# Altium project radxa_cm3_io_board_v1360_schematic.PrjPcb (part 4 of 5)

## Sheet 15.Power-DC IN.SchDoc: CM3 IO
size 420 x 297 mm; Page Create Date: March  8, 1995; Page Number: 15; Page Size: A3; Comment: radxa_1010; Page Count: 20; RevCode: 1.36; Doc: Power-DC IN; DsnPath: D:\WMS\黄工\[RC119]CM3_IO_V1.36\对外资料\radxa_cm3_io_board_v1360.DSN; SchematicName: CM3_IO V1.36; PageName: 15.Power-DC IN; PageSize: A3; TopSchematic: True
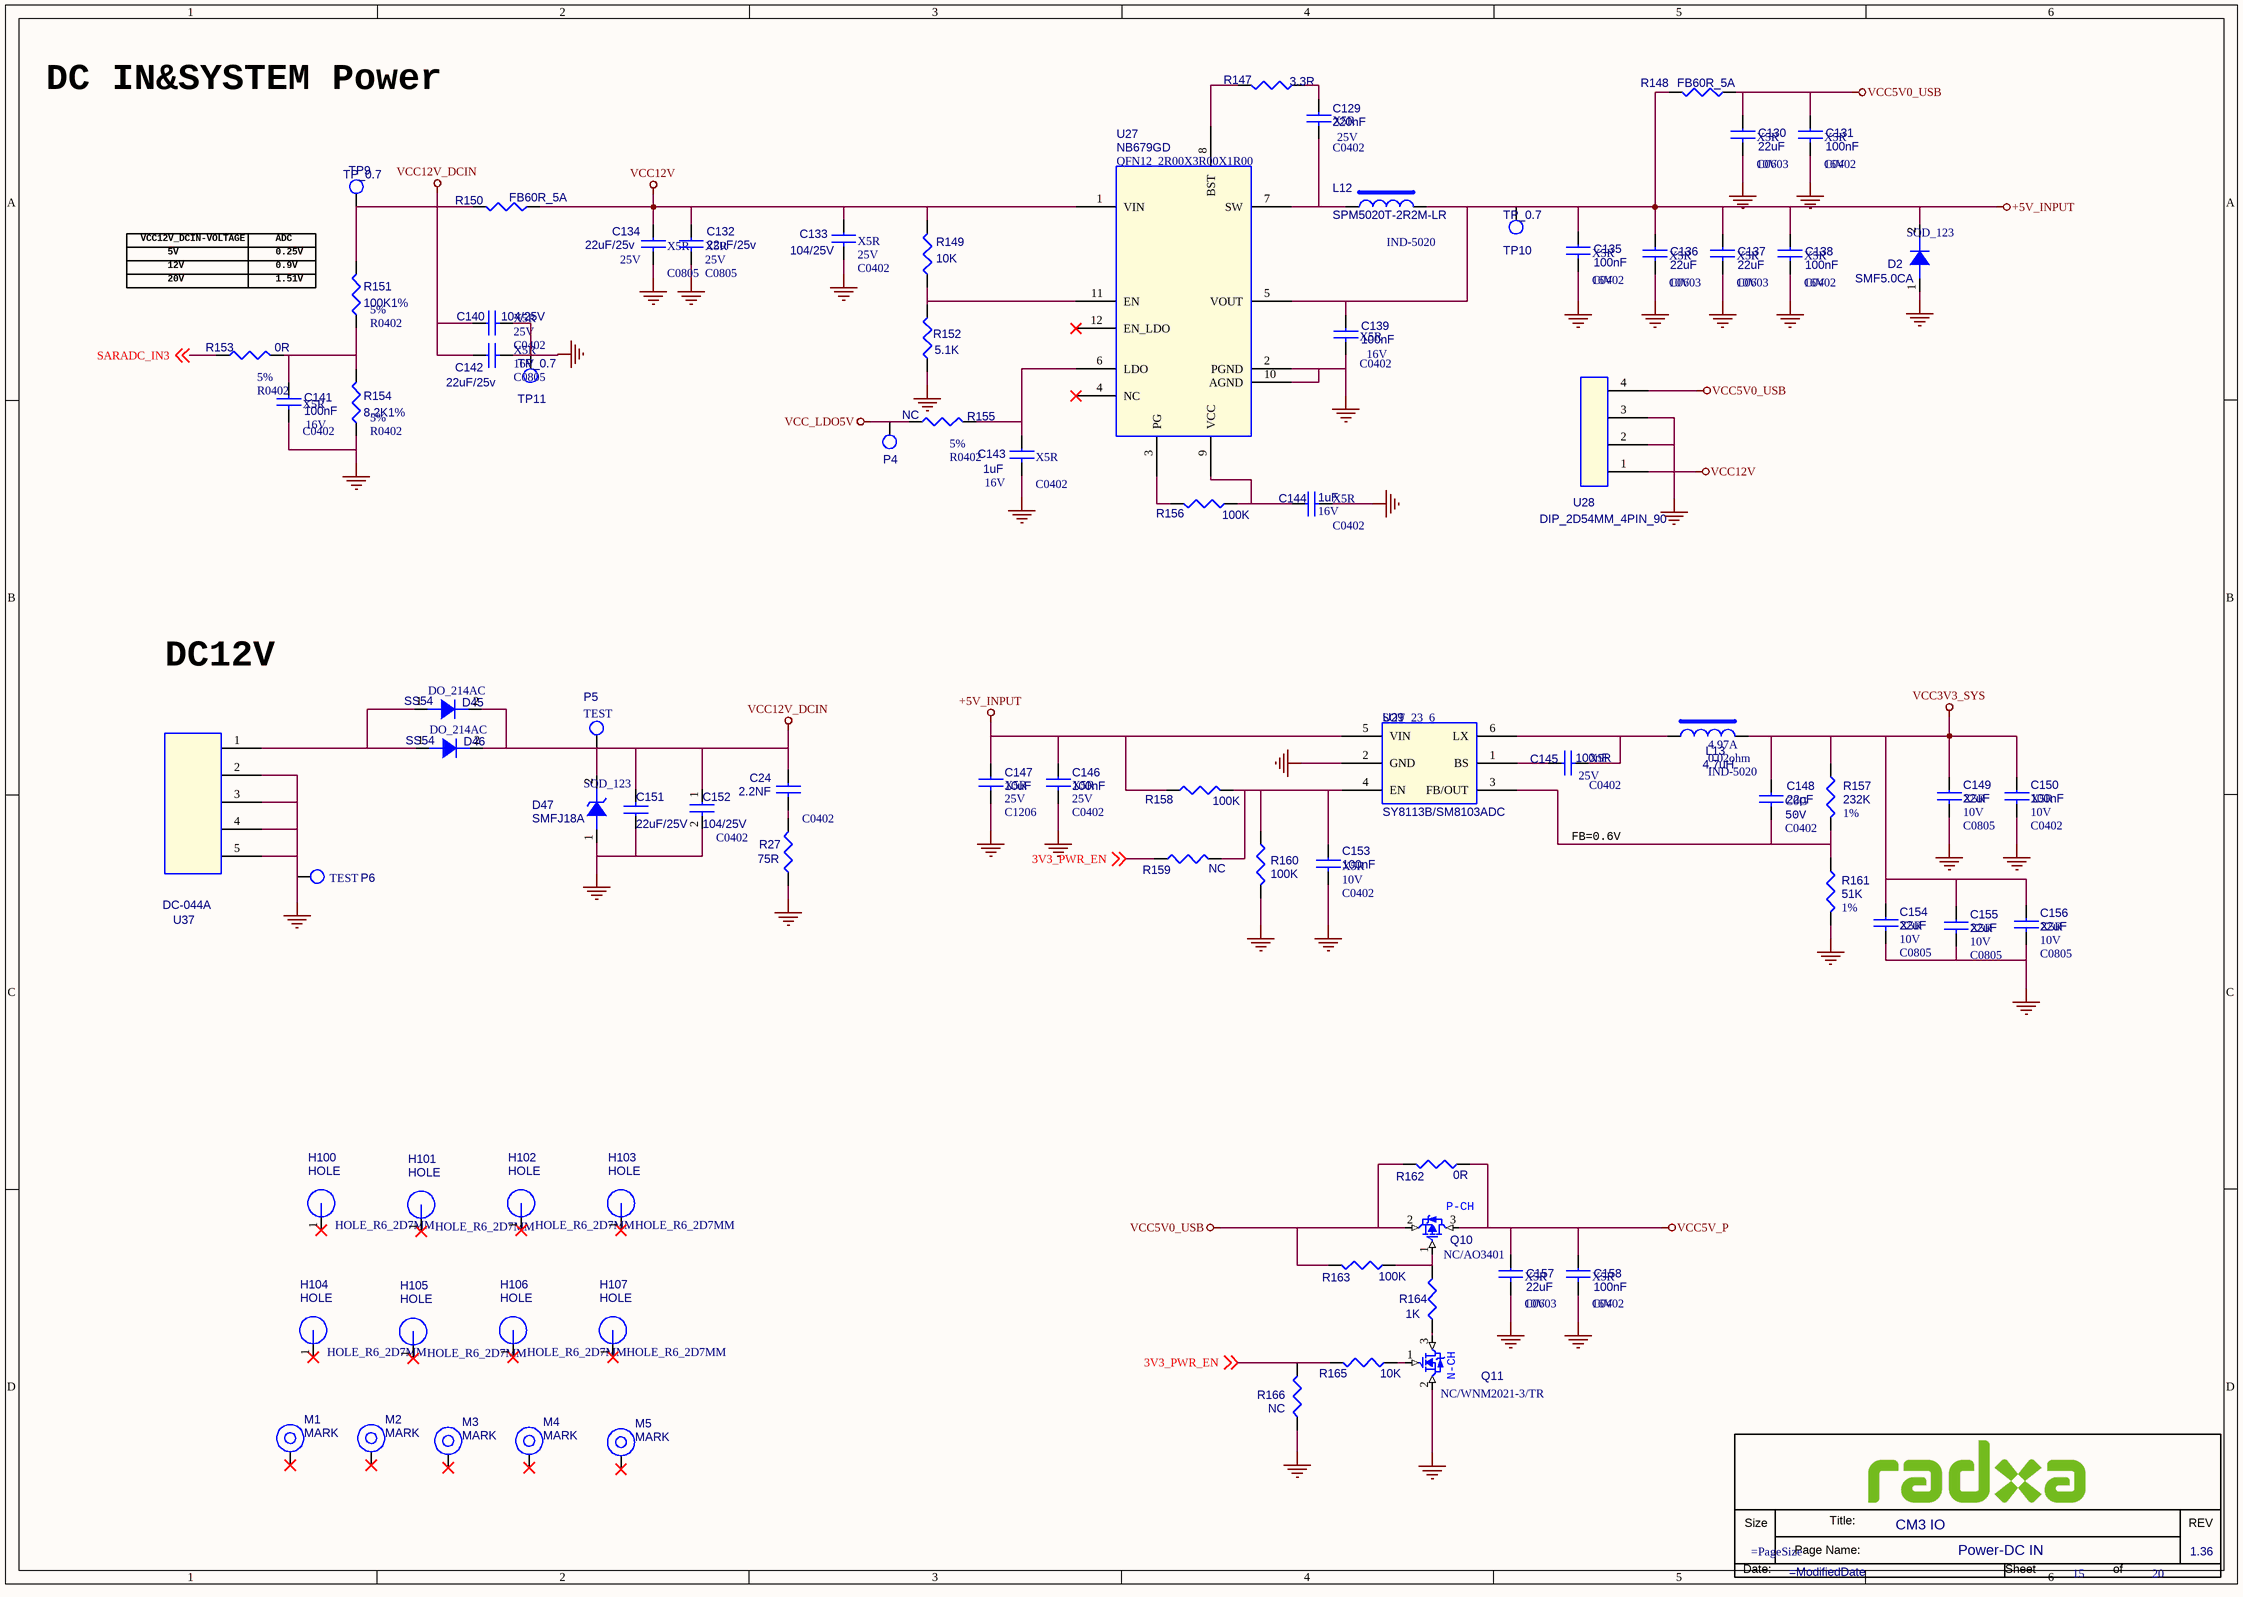
[diagram p13: 15.Power-DC IN.SchDoc]

### Parts
(Parts that share a designator on the sheet are numbered #1, #2 ... from top to bottom, then left to right.)
*#14  Doc: Power-DC IN  RevCode: 1.36  Title: CM3 IO  Page Number: 15  Page Count: 20  (hidden comment: radxa_1010)  (graphical)
C24  2.2NF  [C0402]
C129  220nF  Voltage: 25V  Dielectric: X5R  [C0402]
C130  22uF  Voltage: 10V  Dielectric: X5R  [C0603]
C131  100nF  Voltage: 16V  Dielectric: X5R  [C0402]
C132  22uF/25v  Voltage: 25V  Dielectric: X5R  [C0805]
C133  104/25V  Voltage: 25V  Dielectric: X5R  [C0402]
C134  22uF/25v  Voltage: 25V  Dielectric: X5R  [C0805]
C135  100nF  Voltage: 16V  Dielectric: X5R  [C0402]
C136  22uF  Voltage: 10V  Dielectric: X5R  [C0603]
C137  22uF  Voltage: 10V  Dielectric: X5R  [C0603]
C138  100nF  Voltage: 16V  Dielectric: X5R  [C0402]
C139  100nF  Voltage: 16V  Dielectric: X5R  [C0402]
C140  104/25V  Voltage: 25V  Dielectric: X5R  [C0402]
C141  100nF  Voltage: 16V  Dielectric: X5R  [C0402]
C142  22uF/25v  Voltage: 16V  Dielectric: X5R  [C0805]
C143  1uF  Voltage: 16V  Dielectric: X5R  [C0402]
C144  1uF  Voltage: 16V  Dielectric: X5R  [C0402]
C145  100nF  Voltage: 25V  Dielectric: X5R  [C0402]
C146  100nF  Voltage: 25V  Dielectric: X5R  [C0402]
C147  10uF  Voltage: 25V  Dielectric: X5R  [C1206]
C148  22pF  Voltage: 50V  Dielectric: C0G  [C0402]
C149  22uF  Voltage: 10V  Dielectric: X5R  [C0805]
C150  100nF  Voltage: 10V  Dielectric: X5R  [C0402]
C151  22uF/25V  [C0805]
C152  104/25V  [C0402]
C153  100nF  Voltage: 10V  Dielectric: X5R  [C0402]
C154  22uF  Voltage: 10V  Dielectric: X5R  [C0805]
C155  22uF  Voltage: 10V  Dielectric: X5R  [C0805]
C156  22uF  Voltage: 10V  Dielectric: X5R  [C0805]
C157  22uF  Voltage: 10V  Dielectric: X5R  [C0603]
C158  100nF  Voltage: 16V  Dielectric: X5R  [C0402]
D2  SMF5.0CA  [SOD_123]
D45  SS54  [DO_214AC]
D46  SS54  [DO_214AC]
D47  SMFJ18A  [SOD_123]
H100  HOLE  PCB Footprint: HOLE_R6_2D7MM  [H3.8MM]
H101  HOLE  PCB Footprint: HOLE_R6_2D7MM  [H3.8MM]
H102  HOLE  PCB Footprint: HOLE_R6_2D7MM  [H3.8MM]
H103  HOLE  PCB Footprint: HOLE_R6_2D7MM  [H3.8MM]
H104  HOLE  PCB Footprint: HOLE_R6_2D7MM  [H3.8MM]
H105  HOLE  PCB Footprint: HOLE_R6_2D7MM  [H3.8MM]
H106  HOLE  PCB Footprint: HOLE_R6_2D7MM  [H3.8MM]
H107  HOLE  PCB Footprint: HOLE_R6_2D7MM  [H3.8MM]
L12  SPM5020T-2R2M-LR  [IND-5020]
L13  4.7uH  DC Resistor: 0.02ohm  Isat: 4.97A  [IND-5020]
M1  MARK  [MARK]
M2  MARK  [MARK]
M3  MARK  [MARK]
M4  MARK  [MARK]
M5  MARK  [MARK]
P4  TEST  [TEST]  (value not drawn)
P5  TEST  [TEST]
P6  TEST  [TEST]
Q10  NC/AO3401  [S0T-23]
Q11  NC/WNM2021-3/TR  [S0T-23]
R27  75R  [R0402]
R147  3.3R  [R0402]
R148  FB60R_5A  [R1206]
R149  10K  [R0402]
R150  FB60R_5A  [R1206]
R151  100K1%  Tolerance: 5%  [R0402]
R152  5.1K  [R0402]
R153  0R  Tolerance: 5%  [R0402]
R154  8.2K1%  Tolerance: 5%  [R0402]
R155  NC  Tolerance: 5%  [R0402]
R156  100K  [R0402]
R157  232K  Tolerance: 1%  [R0402]
R158  100K  [R0402]
R159  NC  [R0402]
R160  100K  [R0402]
R161  51K  Tolerance: 1%  [R0402]
R162  0R  [R0603]
R163  100K  [R0402]
R164  1K  [R0402]
R165  10K  [R0402]
R166  NC  [R0402]
TP9  TP_0.7  [TEST]
TP10  TP_0.7  [TEST]
TP11  TP_0.7  [TEST]
U27  NB679GD  PCB Footprint: QFN12_2R00X3R00X1R00  [QFN12_3R00X2R00X0R90]
U28  DIP_2D54MM_4PIN_90  [XIAO_4PIN_2D54]
U29  SY8113B/SM8103ADC  [SOT_23_6]
U37  DC-044A  [DC-044A]

### Nets
+5V_INPUT: C135.1 C136.1 C137.1 C138.1 C139.1 C146.1 C147.1 D2.2(K) L12.2 R148.2 R158.1 TP10.1 U27.5(VOUT) U29.5(VIN)
GND: C130.2 C131.2 C132.2 C133.2 C134.2 C135.2 C136.2 C137.2 C138.2 C139.2 C140.2 C141.2 C142.2 C143.2 C144.2 C146.2 C147.2 C149.2 C150.2 C151.1 C152.2 C153.2 C154.2 C155.2 C156.2 C157.2 C158.2 D2.1(A) D47.1(ANODE) P6.1 Q11.2(S) R27.1 R152.1 R154.1 R160.2 R161.2 R166.2 TP11.1 U27.2(PGND) U27.10(AGND) U28.2 U28.3 U29.2(GND) U37.2 U37.3 U37.4 U37.5
VCC3V3_SYS: C148.1 C149.1 C150.1 C154.1 C155.1 C156.1 L13.2 R157.1
VCC5V0_USB: C130.1 C131.1 Q10.2(S) R148.1 R162.2 R163.2 U28.4
VCC5V_P: C157.1 C158.1 Q10.3(D) R162.1
VCC12V: C132.1 C133.1 C134.1 R149.2 R150.1 U27.1(VIN) U28.1
VCC12V_DCIN: C24.1 C140.1 C142.1 C151.2 C152.1 D45.2(K) D46.2(K) D47.2(CATHODE) P5.1
VCC_LDO5V: P4.1 R155.1
3V3_PWR_EN: R159.1 R165.2 R166.1 ; off-sheet 3V3_PWR_EN
SARADC_IN3: R153.1 ; off-sheet SARADC_IN3
NetC24_2: C24.2 R27.2
NetC129_1: C129.1 R147.2
NetC129_2: C129.2 L12.1 U27.7(SW)
NetC141_1: C141.1 R151.1 R153.2 R154.2
NetC143_1: C143.1 R155.2 U27.6(LDO)
NetC144_1: C144.1 R156.2 U27.9(VCC)
NetC145_1: C145.1 U29.1(BS)
NetC145_2: C145.2 L13.1 U29.6(LX)
NetC148_2: C148.2 R157.2 R161.1 U29.3(FB/OUT)
NetC153_1: C153.1 R158.2 R159.2 R160.1 U29.4(EN)
NetD45_1: D45.1(A) D46.1(A) U37.1
NetQ10_1: Q10.1(G) R163.1 R164.1
NetQ11_1: Q11.1(G) R165.1
NetQ11_3: Q11.3(D) R164.2
NetR147_1: R147.1 U27.8(BST)
NetR149_1: R149.1 R152.2 U27.11(EN)
NetR150_2: R150.2 R151.2 TP9.1
NetR156_1: R156.1 U27.3(PG)

Not connected (* = marked no-connect by the designer): H100 1*; H101 1*; H102 1*; H103 1*; H104 1*; H105 1*; H106 1*; H107 1*; M1 1*; M2 1*; M3 1*; M4 1*; M5 1*; U27 4(NC)* 12(EN_LDO)*

### Notes on the sheet
- DC IN&SYSTEM Power
- VCC12V_DCIN-VOLTAGE
- 5V
- ADC
- 0.25V
- 12V
- 20V
- 1.51V
- 0.9V
- DC12V
- FB=0.6V
- (in symbol N-MOSFET) N-CH
- (in symbol P-MOSFET) P-CH
- (in symbol radxa_1010) Size; Title:; REV; Page Name:; Date:; Sheet; of

### Library data of the parts
C24 = CAP NP_0: Part Reference: C24; Priority: A; PCB Footprint: C0402; Value: 2.2NF
C129 = CAP NP_0: cap,220.00nF,+/-10%,25V,X5R,C0402; Part Reference: C129; Manufacturer PN: C1005X5R1E224K050BC; Manufacturer: TDK; Tolerance: 10%; Priority: A; PCB Footprint: C0402; Value: 220nF; Created by: JJJ; Part Type: C0402; RK PN: C1005X5R1E224K050BC
C130 = CAP NP_0: cap,22.00uF,+/-10%,10V,X5R,C0805; Part Reference: C130; Manufacturer PN: C2012X5R1A226K125AB; Manufacturer: TDK; Tolerance: 10%; Priority: A; PCB Footprint: C0603; Value: 22uF; Created by: JJJ; Part Type: C0805; RK PN: C2012X5R1A226K125AB
C131 = CAP NP_0: cap,100.00nF,+/-10%,16V,X5R,C0402; Part Reference: C131; Manufacturer: TDK; RK PN: C1005X5R1C104K050BA; Priority: A; Tolerance: 10%; PCB Footprint: C0402; Value: 100nF; Part Type: C0402; Manufacturer PN: C1005X5R1C104K050BA; Created by: JJJ
C132 = CAP NP_0: cap,10.00uF,+/-10%,16V,X5R,C0805; Part Reference: C132; Manufacturer PN: C2012X5R1C106K125AC; Manufacturer: TDK; Tolerance: 10%; Priority: A; PCB Footprint: C0805; Value: 22uF/25v; Created by: JJJ; Part Type: C0805; RK PN: C2012X5R1C106K125AC
C133 = CAP NP_0: cap,1.00uF,+/-10%,16V,X5R,C0402; Part Reference: C133; Manufacturer: TDK; RK PN: C1005X5R1C105K050BC; Priority: A; Tolerance: 10%; PCB Footprint: C0402; Value: 104/25V; Part Type: C0402; Manufacturer PN: C1005X5R1C105K050BC; Created by: JJJ
C134 = CAP NP_0: cap,10.00uF,+/-10%,16V,X5R,C0805; Part Reference: C134; Manufacturer: TDK; RK PN: C2012X5R1C106K125AC; Priority: A; Tolerance: 10%; PCB Footprint: C0805; Value: 22uF/25v; Part Type: C0805; Manufacturer PN: C2012X5R1C106K125AC; Created by: JJJ
C135 = CAP NP_0: cap,100.00nF,+/-10%,16V,X5R,C0402; Part Reference: C135; Manufacturer: TDK; RK PN: C1005X5R1C104K050BA; Priority: A; Tolerance: 10%; PCB Footprint: C0402; Value: 100nF; Part Type: C0402; Manufacturer PN: C1005X5R1C104K050BA; Created by: JJJ
C136 = CAP NP_0: cap,22.00uF,+/-10%,10V,X5R,C0805; Part Reference: C136; Manufacturer PN: C2012X5R1A226K125AB; Manufacturer: TDK; Tolerance: 10%; Priority: A; PCB Footprint: C0603; Value: 22uF; Created by: JJJ; Part Type: C0805; RK PN: C2012X5R1A226K125AB
C137 = CAP NP_0: cap,22.00uF,+/-10%,10V,X5R,C0805; Part Reference: C137; Manufacturer PN: C2012X5R1A226K125AB; Manufacturer: TDK; Tolerance: 10%; Priority: A; PCB Footprint: C0603; Value: 22uF; Created by: JJJ; Part Type: C0805; RK PN: C2012X5R1A226K125AB
C138 = CAP NP_0: cap,100.00nF,+/-10%,16V,X5R,C0402; Part Reference: C138; Manufacturer: TDK; RK PN: C1005X5R1C104K050BA; Priority: A; Tolerance: 10%; PCB Footprint: C0402; Value: 100nF; Part Type: C0402; Manufacturer PN: C1005X5R1C104K050BA; Created by: JJJ
C139 = CAP NP_0: cap,100.00nF,+/-10%,16V,X5R,C0402; Part Reference: C139; Manufacturer PN: C1005X5R1C104K050BA; Manufacturer: TDK; Tolerance: 10%; Priority: A; PCB Footprint: C0402; Value: 100nF; Created by: JJJ; Part Type: C0402; RK PN: C1005X5R1C104K050BA
C140 = CAP NP_0: cap,1.00uF,+/-10%,16V,X5R,C0402; Part Reference: C140; Manufacturer PN: C1005X5R1C105K050BC; Manufacturer: TDK; Tolerance: 10%; Priority: A; PCB Footprint: C0402; Value: 104/25V; Created by: JJJ; Part Type: C0402; RK PN: C1005X5R1C105K050BC
C141 = CAP NP_0: cap,100.00nF,+/-10%,16V,X5R,C0402; Part Reference: C141; Manufacturer: TDK; RK PN: C1005X5R1C104K050BA; Priority: A; Tolerance: 10%; PCB Footprint: C0402; Value: 100nF; Part Type: C0402; Manufacturer PN: C1005X5R1C104K050BA; Created by: JJJ
C142 = CAP NP_0: cap,10.00uF,+/-10%,16V,X5R,C0805; Part Reference: C142; Manufacturer PN: C2012X5R1C106K125AC; Manufacturer: TDK; Tolerance: 10%; Priority: A; PCB Footprint: C0805; Value: 22uF/25v; Created by: JJJ; Part Type: C0805; RK PN: C2012X5R1C106K125AC
C143 = CAP NP_0: cap,1.00uF,+/-10%,16V,X5R,C0402; Part Reference: C143; Manufacturer PN: C1005X5R1C105K050BC; Manufacturer: TDK; Tolerance: 10%; Priority: A; PCB Footprint: C0402; Value: 1uF; Created by: JJJ; Part Type: C0402; RK PN: C1005X5R1C105K050BC
C144 = CAP NP_0: cap,1.00uF,+/-10%,16V,X5R,C0402; Part Reference: C144; Manufacturer PN: C1005X5R1C105K050BC; Manufacturer: TDK; Tolerance: 10%; Priority: A; PCB Footprint: C0402; Value: 1uF; Created by: JJJ; Part Type: C0402; RK PN: C1005X5R1C105K050BC
C145 = CAP NP_0: cap,100.00nF,+/-10%,25V,X5R,C0402; Part Reference: C145; Manufacturer: TDK; Number: 37; RK PN: C1005X5R1E104K050BC; Priority: A; Tolerance: 10%; C_Voltage: 6.3V; PCB Footprint: C0402; Value: 100nF; Part Type: C0402; Manufacturer PN: C1005X5R1E104K050BC; Created by: JJJ
C146 = CAP NP_0: cap,100.00nF,+/-10%,25V,X5R,C0402; Part Reference: C146; Manufacturer PN: C1005X5R1E104K050BC; Manufacturer: TDK; Tolerance: 10%; Priority: A; PCB Footprint: C0402; Value: 100nF; Created by: JJJ; Part Type: C0402; RK PN: C1005X5R1E104K050BC
C147 = CAP NP_0: cap,10.00uF,+/-10%,25V,X5R,C1206; Part Reference: C147; Manufacturer: TDK; RK PN: C3216X5R1E106K085AC; Priority: A; C_Voltage: 6.3V; Tolerance: 10%; PCB Footprint: C1206; Value: 10uF; Part Type: C1206; Manufacturer PN: C3216X5R1E106K085AC; Created by: JJJ
C148 = CAP NP_0: cap,22.00pF,+/-5%,50V,C0G,C0402; Part Reference: C148; Manufacturer: TDK; RK PN: C1005C0G1H220J050BA; Priority: A; Tolerance: 5%; PCB Footprint: C0402; Value: 22pF; Part Type: C0402; Manufacturer PN: C1005C0G1H220J050BA; Created by: JJJ
C149 = CAP NP_0: cap,22.00uF,+/-10%,10V,X5R,C0805; Part Reference: C149; Manufacturer: TDK; RK PN: C2012X5R1A226K125AB; Priority: A; C_Voltage: 6.3V; Tolerance: 10%; PCB Footprint: C0805; Value: 22uF; Part Type: C0805; Manufacturer PN: C2012X5R1A226K125AB; Created by: JJJ
C150 = CAP NP_0: cap,100.00nF,+/-10%,10V,X5R,C0402; Part Reference: C150; Manufacturer: TDK; Number: 37; RK PN: C1005X5R1A104K050BA; Priority: A; Tolerance: 10%; C_Voltage: 6.3V; PCB Footprint: C0402; Value: 100nF; Part Type: C0402; Manufacturer PN: C1005X5R1A104K050BA; Created by: JJJ
C151 = CAP NP_4: Part Reference: C151; Value: 22uF/25V; PCB Footprint: C0805
C152 = CAP NP: CAP,MLCC,1nF,+/-10%,X5R,6.3V,SMD0402; Part Reference: C152; MARK: 22P; ROOM: USB+5V; PCB Footprint: C0402; Value: 104/25V
C153 = CAP NP_0: cap,100.00nF,+/-10%,10V,X5R,C0402; Part Reference: C153; Manufacturer PN: C1005X5R1A104K050BA; Manufacturer: TDK; C_Voltage: 6.3V; Tolerance: 10%; Priority: A; Number: 37; PCB Footprint: C0402; Value: 100nF; Created by: JJJ; Part Type: C0402; RK PN: C1005X5R1A104K050BA
C154 = CAP NP_0: cap,22.00uF,+/-10%,10V,X5R,C0805; Part Reference: C154; Manufacturer PN: C2012X5R1A226K125AB; Manufacturer: TDK; Tolerance: 10%; C_Voltage: 6.3V; Priority: A; PCB Footprint: C0805; Value: 22uF; Created by: JJJ; Part Type: C0805; RK PN: C2012X5R1A226K125AB
C155 = CAP NP_0: cap,22.00uF,+/-10%,10V,X5R,C0805; Part Reference: C155; Manufacturer: TDK; RK PN: C2012X5R1A226K125AB; Priority: A; C_Voltage: 6.3V; Tolerance: 10%; PCB Footprint: C0805; Value: 22uF; Part Type: C0805; Manufacturer PN: C2012X5R1A226K125AB; Created by: JJJ
C156 = CAP NP_0: cap,22.00uF,+/-10%,10V,X5R,C0805; Part Reference: C156; Manufacturer PN: C2012X5R1A226K125AB; Manufacturer: TDK; Tolerance: 10%; C_Voltage: 6.3V; Priority: A; PCB Footprint: C0805; Value: 22uF; Created by: JJJ; Part Type: C0805; RK PN: C2012X5R1A226K125AB
C157 = CAP NP_0: cap,22.00uF,+/-10%,10V,X5R,C0805; Part Reference: C157; Manufacturer: TDK; RK PN: C2012X5R1A226K125AB; Priority: A; Tolerance: 10%; PCB Footprint: C0603; Value: 22uF; Part Type: C0805; Manufacturer PN: C2012X5R1A226K125AB; Created by: JJJ
C158 = CAP NP_0: cap,100.00nF,+/-10%,16V,X5R,C0402; Part Reference: C158; Manufacturer: TDK; RK PN: C1005X5R1C104K050BA; Priority: A; Tolerance: 10%; PCB Footprint: C0402; Value: 100nF; Part Type: C0402; Manufacturer PN: C1005X5R1C104K050BA; Created by: JJJ
D2 = DIODE: Schottky Barrier，B5819WS SOD-323; Part Reference: D2; Manufacturer: 长电; Priority: A; PCB Footprint: SOD_123; Value: SMF5.0CA; Created by: JJJ; Manufacturer PN: B5819WS; Part Type: Schottky rectifier; RK PN: B5819WS
D45 = DIODE: Schottky Barrier，SS32 DO214AC; Part Reference: D45; Manufacturer PN: SS32; Manufacturer: 星海; Priority: A; ROOM: CHG; PCB Footprint: DO_214AC; Value: SS54; Created by: JJJ; Part Type: Schottky rectifier; RK PN: SS32
D46 = DIODE: Schottky Barrier，SS32 DO214AC; Part Reference: D46; Manufacturer: 星海; ROOM: CHG; RK PN: SS32; Priority: A; PCB Footprint: DO_214AC; Value: SS54; Part Type: Schottky rectifier; Manufacturer PN: SS32; Created by: JJJ
D47 = DIODE ZENER1: 1-Line, Uni-directional, Transient Voltage Suppressor; Part Reference: D47; Manufacturer PN: ESD5621W-2/TR; Manufacturer: WillSemi(韦尔半导体); Priority: A; PCB Footprint: SOD_123; Value: SMFJ18A; Created by: JJJ; Part Type: ESD_TVS; RK PN: ESD5621W-2/TR
H100 = HOLE: 直径3.5mm hole; Part Reference: H100; RK PN: HOLE_3R50; Priority: A; Value: HOLE; Part Type: HOLE; Created by: CZD
H101 = HOLE: 直径3.5mm hole; Part Reference: H101; RK PN: HOLE_3R50; Priority: A; Value: HOLE; Part Type: HOLE; Created by: CZD
H102 = HOLE: 直径3.5mm hole; Part Reference: H102; RK PN: HOLE_3R50; Priority: A; Value: HOLE; Part Type: HOLE; Created by: CZD
H103 = HOLE: 直径3.5mm hole; Part Reference: H103; RK PN: HOLE_3R50; Priority: A; Value: HOLE; Part Type: HOLE; Created by: CZD
H104 = HOLE: 直径3.5mm hole; Part Reference: H104; Priority: A; RK PN: HOLE_3R50; Value: HOLE; Created by: CZD; Part Type: HOLE
H105 = HOLE: 直径3.5mm hole; Part Reference: H105; Priority: A; RK PN: HOLE_3R50; Value: HOLE; Created by: CZD; Part Type: HOLE
H106 = HOLE: 直径3.5mm hole; Part Reference: H106; Priority: A; RK PN: HOLE_3R50; Value: HOLE; Created by: CZD; Part Type: HOLE
H107 = HOLE: 直径3.5mm hole; Part Reference: H107; Priority: A; RK PN: HOLE_3R50; Value: HOLE; Created by: CZD; Part Type: HOLE
L12 = INDUCTORS OF FERRITE: Part Reference: L12; PCB Footprint: IND-5020; Value: SPM5020T-2R2M-LR
L13 = INDUCTORS OF FERRITE: Power Inductor,4.7uH,0.2,IND_606045; Part Reference: L13; Manufacturer PN: SWPA6045S4R7MT; Manufacturer: sunlord; Resonace frequency: 24M; Irms: 3.3A; Tolerance: 20%; Priority: A; PCB Footprint: IND-5020; Value: 4.7uH; Created by: YWQ; Part Type: POWER_IND; RK PN: SWPA6045S4R7MT
M1 = MARK: MARK Symble; Part Reference: M1; Priority: A; RK PN: MARK01; PCB Footprint: MARK; Value: MARK; Created by: JJJ; Part Type: MARK
M2 = MARK: MARK Symble; Part Reference: M2; RK PN: MARK01; Priority: A; PCB Footprint: MARK; Value: MARK; Part Type: MARK; Created by: JJJ
M3 = MARK: MARK Symble; Part Reference: M3; RK PN: MARK01; Priority: A; PCB Footprint: MARK; Value: MARK; Part Type: MARK; Created by: JJJ
M4 = MARK: MARK Symble; Part Reference: M4; Priority: A; RK PN: MARK01; PCB Footprint: MARK; Value: MARK; Created by: JJJ; Part Type: MARK
M5 = MARK: MARK Symble; Part Reference: M5; RK PN: MARK01; Priority: A; PCB Footprint: MARK; Value: MARK; Part Type: MARK; Created by: JJJ
P4 = TESTPOINT1: Part Reference: P4; PCB Footprint: TP_0R70; Value: TEST
P5 = TESTPOINT1: Part Reference: P5; PCB Footprint: TP_0R70; Value: TEST
P6 = TESTPOINT1: Part Reference: P6; PCB Footprint: TP_0R70; Value: TEST
Q10 = P-MOSFET: Part Reference: Q10; SANZ_P/N: SK2301; Value: NC/AO3401; Part Type: MOS管; PCB Footprint: S0T-23
Q11 = N-MOSFET: Part Reference: Q11; SANZ_P/N: SK2300; Value: NC/WNM2021-3/TR; Part Type: MOS管; PCB Footprint: S0T-23
R27 = RESISTOR_0: 通用厚膜电阻,330R,+/-5%,R0402,1/16W.; Part Reference: R27; Manufacturer PN: RC0402JR-07330RL; Manufacturer: YAGEO; Wattage: 1/16W; Tolerance: 5%; Priority: A; Value: 75R; Created by: YTL; Part Type: 通用厚膜电阻; RK PN: RC0402JR-07330RL; PCB Footprint: R0402
R147 = RESISTOR_0: 通用厚膜电阻,3R3,+/-5%,R0402,1/16W.; Part Reference: R147; Manufacturer PN: RC0402JR-073R3L; Manufacturer: YAGEO; Wattage: 1/16W; Tolerance: 5%; Priority: A; Value: 3.3R; Created by: YTL; Part Type: 通用厚膜电阻; RK PN: RC0402JR-073R3L; PCB Footprint: R0402
R148 = R_0: Part Reference: R148; Value: FB60R_5A; PCB Footprint: R1206
R149 = RESISTOR_0: 通用厚膜电阻,10K,+/-5%,R0402,1/16W.; Part Reference: R149; Manufacturer PN: RC0402JR-0710KL; Manufacturer: YAGEO; Wattage: 1/16W; Tolerance: 5%; Priority: A; Value: 10K; Created by: YTL; Part Type: 通用厚膜电阻; RK PN: RC0402JR-0710KL; PCB Footprint: R0402
R150 = R_0: Part Reference: R150; Value: FB60R_5A; PCB Footprint: R1206
R151 = RESISTOR_2: 通用厚膜电阻,10K,+/-5%,R0402,1/16W.; Part Reference: R151; Manufacturer: YAGEO; RK PN: RC0402JR-0710KL; Priority: A; Wattage: 1/16W; PCB Footprint: R0402; Value: 100K1%; Part Type: 通用厚膜电阻; Manufacturer PN: RC0402JR-0710KL; Created by: YTL
R152 = RESISTOR_0: 通用厚膜电阻,10K,+/-5%,R0402,1/16W.; Part Reference: R152; Manufacturer: YAGEO; RK PN: RC0402JR-0710KL; Priority: A; Tolerance: 5%; Wattage: 1/16W; Value: 5.1K; Part Type: 通用厚膜电阻; Manufacturer PN: RC0402JR-0710KL; Created by: YTL; PCB Footprint: R0402
R153 = RESISTOR_2: 通用厚膜电阻,10K,+/-5%,R0402,1/16W.; Part Reference: R153; Manufacturer: YAGEO; RK PN: RC0402JR-0710KL; Priority: A; Wattage: 1/16W; PCB Footprint: R0402; Value: 0R; Part Type: 通用厚膜电阻; Manufacturer PN: RC0402JR-0710KL; Created by: YTL
R154 = RESISTOR_2: 通用厚膜电阻,10K,+/-5%,R0402,1/16W.; Part Reference: R154; Manufacturer PN: RC0402JR-0710KL; Manufacturer: YAGEO; Wattage: 1/16W; Priority: A; PCB Footprint: R0402; Value: 8.2K1%; Created by: YTL; Part Type: 通用厚膜电阻; RK PN: RC0402JR-0710KL
R155 = RESISTOR_2: 通用厚膜电阻,10K,+/-5%,R0402,1/16W.; Part Reference: R155; Manufacturer: YAGEO; RK PN: RC0402JR-0710KL; Priority: A; Wattage: 1/16W; PCB Footprint: R0402; Value: NC; Part Type: 通用厚膜电阻; Manufacturer PN: RC0402JR-0710KL; Created by: YTL
R156 = RESISTOR_0: 通用厚膜电阻,100K,+/-5%,R0402,1/16W.; Part Reference: R156; Manufacturer: YAGEO; RK PN: RC0402JR-07100KL; Priority: A; Tolerance: 5%; Wattage: 1/16W; Value: 100K; Part Type: 通用厚膜电阻; Manufacturer PN: RC0402JR-07100KL; Created by: YTL; PCB Footprint: R0402
R157 = RESISTOR_0: 通用厚膜电阻,232K,+/-1%,R0402,1/16W.; Part Reference: R157; Manufacturer: YAGEO; RK PN: RC0402FR-07232KL; Priority: A; Wattage: 1/16W; Value: 232K; Part Type: 通用厚膜电阻; Manufacturer PN: RC0402FR-07232KL; Created by: YTL; PCB Footprint: R0402
R158 = RESISTOR_0: 通用厚膜电阻,100K,+/-5%,R0402,1/16W.; Part Reference: R158; Manufacturer PN: RC0402JR-07100KL; Manufacturer: YAGEO; Wattage: 1/16W; Tolerance: 5%; Priority: A; Value: 100K; Created by: YTL; Part Type: 通用厚膜电阻; RK PN: RC0402JR-07100KL; PCB Footprint: R0402
R159 = RESISTOR_0: 通用厚膜电阻,100K,+/-5%,R0402,1/16W.; Part Reference: R159; Manufacturer PN: RC0402JR-07100KL; Manufacturer: YAGEO; Wattage: 1/16W; Tolerance: 5%; Priority: A; Value: NC; Created by: YTL; Part Type: 通用厚膜电阻; RK PN: RC0402JR-07100KL; PCB Footprint: R0402
R160 = RESISTOR_0: 通用厚膜电阻,24K,+/-5%,R0402,1/16W.; Part Reference: R160; Manufacturer PN: RC0402JR-0724KL; Manufacturer: YAGEO; Wattage: 1/16W; Tolerance: 5%; Priority: A; Value: 100K; Created by: YTL; Part Type: 通用厚膜电阻; RK PN: RC0402JR-0724KL; PCB Footprint: R0402
R161 = RESISTOR_0: 通用厚膜电阻,49K9,+/-1%,R0402,1/16W.; Part Reference: R161; Manufacturer: YAGEO; RK PN: RC0402FR-0749K9L; Priority: A; Wattage: 1/16W; Value: 51K; Part Type: 通用厚膜电阻; Manufacturer PN: RC0402FR-0749K9L; Created by: YTL; PCB Footprint: R0402
R162 = RESISTOR_1: RES,thick film,47KOhm,+/-5%,1/16W,SMD0402; Part Reference: R162; Value: 0R; PCB Footprint: R0603
R163 = RESISTOR_1: RES,thick film,47KOhm,+/-5%,1/16W,SMD0402; Part Reference: R163; Value: 100K; PCB Footprint: R0402
R164 = RESISTOR_0: RES,thick film,47KOhm,+/-5%,1/16W,SMD0402; Part Reference: R164; MARK: 51K; Value: 1K; PCB Footprint: R0402
R165 = RESISTOR_1: RES,thick film,47KOhm,+/-5%,1/16W,SMD0402; Part Reference: R165; Value: 10K; PCB Footprint: R0402
R166 = RESISTOR_0: RES,thick film,47KOhm,+/-5%,1/16W,SMD0402; Part Reference: R166; MARK: 51K; Value: NC; PCB Footprint: R0402
TP9 = TP: Test Point 0.7mm; Part Reference: TP9; PCB Footprint: TP_0R70; RK PN: TESTPOINT_0R7; Priority: A; Value: TP_0.7; Part Type: TP; Created by: JJJ
TP10 = TP: Test Point 0.7mm; Part Reference: TP10; PCB Footprint: TP_0R70; RK PN: TESTPOINT_0R7; Priority: A; Value: TP_0.7; Part Type: TP; Created by: JJJ
TP11 = TP: Test Point 0.7mm; Part Reference: TP11; PCB Footprint: TP_0R70; Priority: A; RK PN: TESTPOINT_0R7; Value: TP_0.7; Created by: JJJ; Part Type: TP
U27 = DCDC_NB679: 26 V, Low Iq, High Current, Fixed 5 V-8 A Synchronous Buck Converter with 100 mA LDO;; Part Reference: U27; Manufacturer: MPS （美国芯源）; Value: NB679GD; RK PN: NB679GD; Priority: A; Part Type: DCDC; Manufacturer PN: NB679GD; Created by: JJJ
U28 = CON3_2: Part Reference: U28; Value: DIP_2D54MM_4PIN_90; PCB Footprint: XIAO_4PIN_2D54
U29 = DCDC_SY8113: Part Reference: U29; Manufacturer: Silergy（矽力杰）; Priority: A; PCB Footprint: SOT_23_6; Value: SY8113B/SM8103ADC; RK PN: SY8113B; Part Type: DCDC; Manufacturer PN: SY8113B; Created by: JJJ
U37 = CON3_7: Part Reference: U37; Value: DC-044A; PCB Footprint: DC-044A
*#14 = radxa_1010: Page Create Date: March  8, 1995; Page Size: =PageSize; Page Modify Date: =ModifiedDate

## Sheet 16.40PIN CONNECT.SchDoc: CM3 IO
size 297 x 209 mm; Page Create Date: March  8, 1995; Page Number: 16; Page Size: A4; Comment: radxa_1010; Page Count: 20; RevCode: 1.36; Doc: 40PIN CONNECT; DsnPath: D:\WMS\黄工\[RC119]CM3_IO_V1.36\对外资料\radxa_cm3_io_board_v1360.DSN; SchematicName: CM3_IO V1.36; PageName: 16.40PIN CONNECT; PageSize: A4; TopSchematic: True
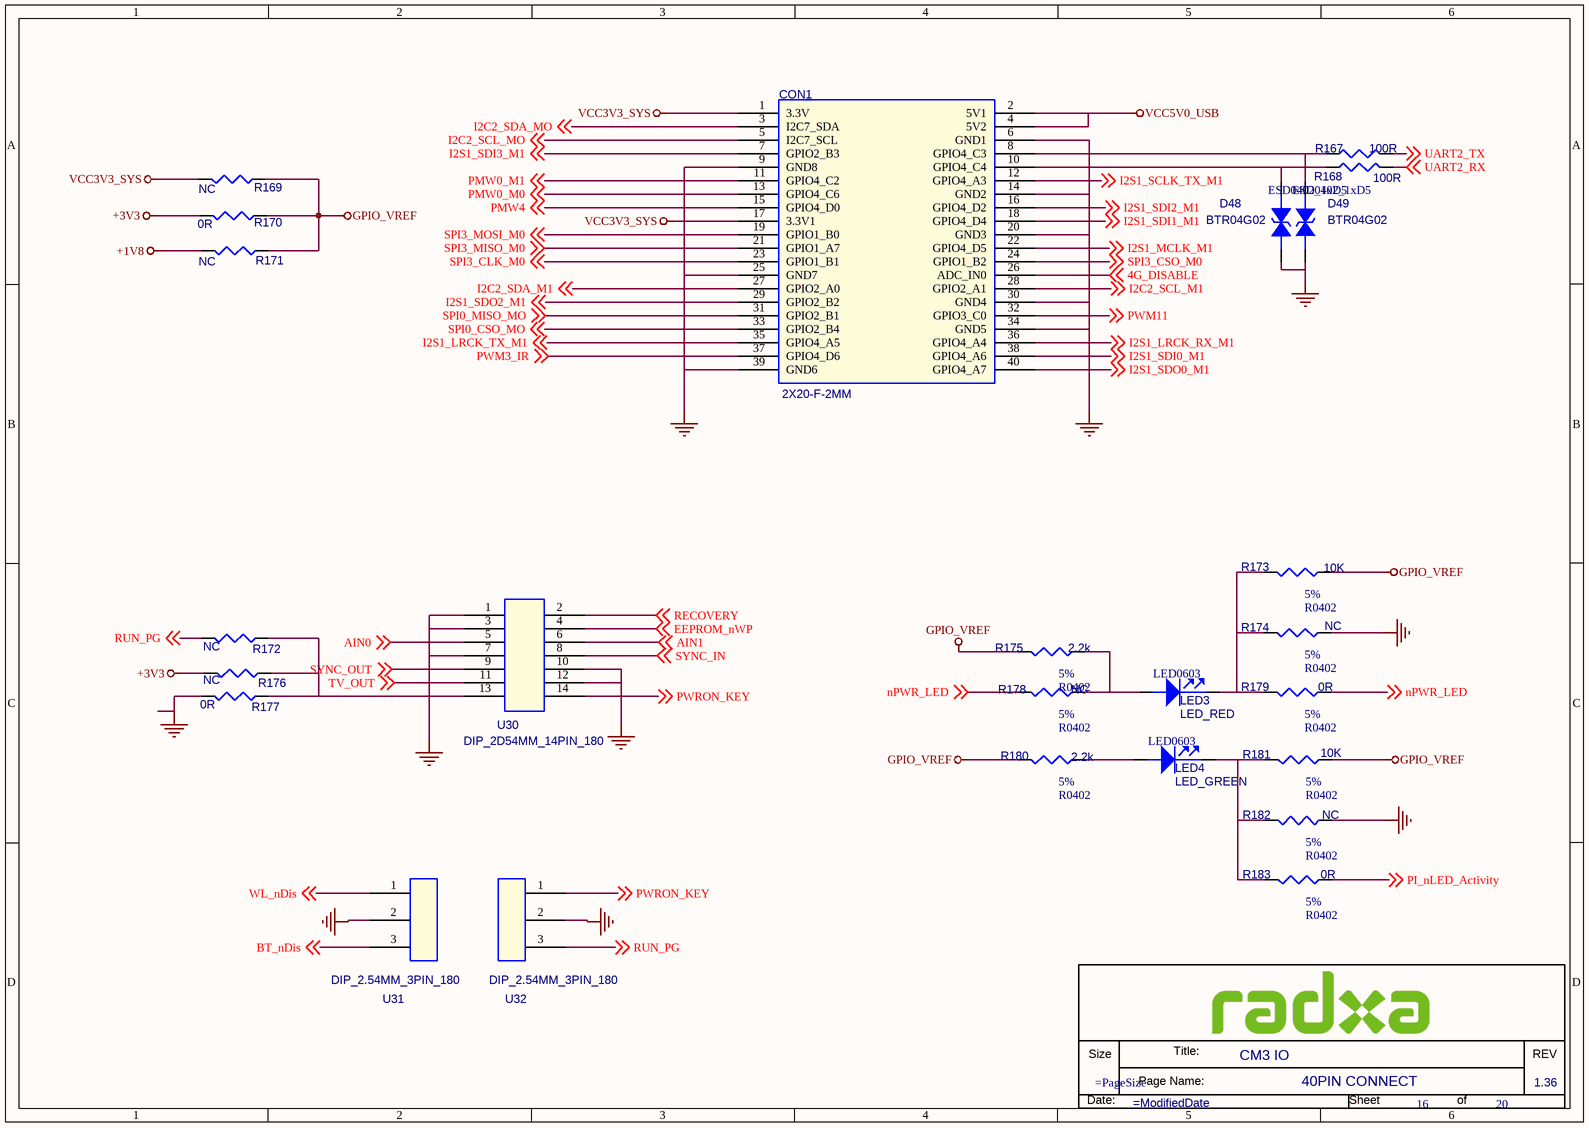
[diagram p14: 16.40PIN CONNECT.SchDoc]

### Parts
(Parts that share a designator on the sheet are numbered #1, #2 ... from top to bottom, then left to right.)
*#15  Doc: 40PIN CONNECT  RevCode: 1.36  Title: CM3 IO  Page Number: 16  Page Count: 20  (hidden comment: radxa_1010)  (graphical)
CON1  2X20-F-2MM  [DIP40PIN_2D54MM]
D48  BTR04G02  [ESD0402_1xD5]
D49  BTR04G02  [ESD0402_1xD5]
LED3  LED_RED  [LED0603]
LED4  LED_GREEN  [LED0603]
R167  100R  [R0402]
R168  100R  [R0402]
R169  NC  [R0603]
R170  0R  [R0603]
R171  NC  [R0603]
R172  NC  [R0402]
R173  10K  Tolerance: 5%  [R0402]
R174  NC  Tolerance: 5%  [R0402]
R175  2.2k  Tolerance: 5%  [R0402]
R176  NC  [R0402]
R177  0R  [R0402]
R178  NC  Tolerance: 5%  [R0402]
R179  0R  Tolerance: 5%  [R0402]
R180  2.2k  Tolerance: 5%  [R0402]
R181  10K  Tolerance: 5%  [R0402]
R182  NC  Tolerance: 5%  [R0402]
R183  0R  Tolerance: 5%  [R0402]
U30  DIP_2D54MM_14PIN_180  [DIP_14PIN-2_54MM]
U31  DIP_2.54MM_3PIN_180  [DIP3_1X2P54]
U32  DIP_2.54MM_3PIN_180  [DIP3_1X2P54]

### Nets
+1V8: R171.2
+3V3: R170.2 R176.2
GND: CON1.6(GND1) CON1.9(GND8) CON1.14(GND2) CON1.20(GND3) CON1.25(GND7) CON1.30(GND4) CON1.34(GND5) CON1.39(GND6) D48.1 D49.1 R174.2 R177.2 R182.2 U30.1 U30.3 U30.7 U30.10 U30.12 U31.2 U32.2
GPIO_VREF: R169.1 R170.1 R171.1 R173.2 R175.1 R180.1 R181.2
VCC3V3_SYS: CON1.1(3.3V) CON1.17(3.3V1) R169.2
VCC5V0_USB: CON1.2(5V1) CON1.4(5V2)
4G_DISABLE: CON1.26(ADC_IN0) ; off-sheet 4G_DISABLE
AIN0: U30.5 ; off-sheet AIN0
AIN1: U30.6 ; off-sheet AIN1
BT_nDis: U31.3 ; off-sheet BT_nDis
EEPROM_nWP: U30.4 ; off-sheet EEPROM_nWP
I2C2_SCL_M1: CON1.28(GPIO2_A1) ; off-sheet I2C2_SCL_M1
I2C2_SCL_MO: CON1.5(I2C7_SCL) ; off-sheet I2C2_SCL_MO
I2C2_SDA_M1: CON1.27(GPIO2_A0) ; off-sheet I2C2_SDA_M1
I2C2_SDA_MO: CON1.3(I2C7_SDA) ; off-sheet I2C2_SDA_MO
I2S1_LRCK_RX_M1: CON1.36(GPIO4_A4) ; off-sheet I2S1_LRCK_RX_M1
I2S1_LRCK_TX_M1: CON1.35(GPIO4_A5) ; off-sheet I2S1_LRCK_TX_M1
I2S1_MCLK_M1: CON1.22(GPIO4_D5) ; off-sheet I2S1_MCLK_M1
I2S1_SCLK_TX_M1: CON1.12(GPIO4_A3) ; off-sheet I2S1_SCLK_TX_M1
I2S1_SDI0_M1: CON1.38(GPIO4_A6) ; off-sheet I2S1_SDI0_M1
I2S1_SDI1_M1: CON1.18(GPIO4_D4) ; off-sheet I2S1_SDI1_M1
I2S1_SDI2_M1: CON1.16(GPIO4_D2) ; off-sheet I2S1_SDI2_M1
I2S1_SDI3_M1: CON1.7(GPIO2_B3) ; off-sheet I2S1_SDI3_M1
I2S1_SDO0_M1: CON1.40(GPIO4_A7) ; off-sheet I2S1_SDO0_M1
I2S1_SDO2_M1: CON1.29(GPIO2_B2) ; off-sheet I2S1_SDO2_M1
nPWR_LED: R178.1 R179.2 ; off-sheet nPWR_LED
PI_nLED_Activity: R183.2 ; off-sheet PI_nLED_Activity
PMW0_M0: CON1.13(GPIO4_C6) ; off-sheet PMW0_M0
PMW0_M1: CON1.11(GPIO4_C2) ; off-sheet PMW0_M1
PMW4: CON1.15(GPIO4_D0) ; off-sheet PMW4
PWM3_IR: CON1.37(GPIO4_D6) ; off-sheet PWM3_IR
PWM11: CON1.32(GPIO3_C0) ; off-sheet PWM11
PWRON_KEY: U30.14 U32.1 ; off-sheet PWRON_KEY
RECOVERY: U30.2 ; off-sheet RECOVERY
RUN_PG: R172.2 U32.3 ; off-sheet RUN_PG
SPI0_CSO_MO: CON1.33(GPIO2_B4) ; off-sheet SPI0_CSO_MO
SPI0_MISO_MO: CON1.31(GPIO2_B1) ; off-sheet SPI0_MISO_MO
SPI3_CLK_M0: CON1.23(GPIO1_B1) ; off-sheet SPI3_CLK_M0
SPI3_CSO_M0: CON1.24(GPIO1_B2) ; off-sheet SPI3_CSO_M0
SPI3_MISO_M0: CON1.21(GPIO1_A7) ; off-sheet SPI3_MISO_M0
SPI3_MOSI_M0: CON1.19(GPIO1_B0) ; off-sheet SPI3_MOSI_M0
SYNC_IN: U30.8 ; off-sheet SYNC_IN
SYNC_OUT: U30.9 ; off-sheet SYNC_OUT
TV_OUT: U30.11 ; off-sheet TV_OUT
UART2_RX: R168.2 ; off-sheet UART2_RX
UART2_TX: R167.2 ; off-sheet UART2_TX
WL_nDis: U31.1 ; off-sheet WL_nDis
NetCON1_8: CON1.8(GPIO4_C3) D49.2 R167.1
NetCON1_10: CON1.10(GPIO4_C4) D48.2 R168.1
NetLED3_1: LED3.1(ANODE) R175.2 R178.2
NetLED3_2: LED3.2(CATHODE) R173.1 R174.1 R179.1
NetLED4_1: LED4.1(ANODE) R180.2
NetLED4_2: LED4.2(CATHODE) R181.1 R182.1 R183.1
NetR172_1: R172.1 R176.1 R177.1 U30.13

### Notes on the sheet
- (in symbol radxa_1010) Size; Title:; REV; Page Name:; Date:; Sheet; of

### Library data of the parts
CON1 = CN_0: Part Reference: CON1; Value: 2X20-F-2MM; PCB Footprint: DIP40PIN_2D54MM
D48 = DIODE BI_DIR TRIG_0: 1-Line, Bi-directional, Transient Voltage Suppressors.17.5pF.; Part Reference: D48; Manufacturer PN: ESD5451N; Manufacturer: WillSemi(韦尔半导体); OPTION: DNP; Priority: A; PCB Footprint: ESD0402_1xD5; Value: BTR04G02; Created by: JJJ; Part Type: ESD_TVS; RK PN: ESD5451N
D49 = DIODE BI_DIR TRIG_0: 1-Line, Bi-directional, Transient Voltage Suppressors.17.5pF.; Part Reference: D49; Manufacturer: WillSemi(韦尔半导体); RK PN: ESD5451N; Priority: A; OPTION: DNP; PCB Footprint: ESD0402_1xD5; Value: BTR04G02; Part Type: ESD_TVS; Manufacturer PN: ESD5451N; Created by: JJJ
LED3 = LED: 贴片LED灯，0603，绿色; Part Reference: LED3; Priority: A; RK PN: LED_GREEN; PCB Footprint: LED0603; Value: LED_RED; Created by: JJJ; Part Type: LED
LED4 = LED: 贴片LED灯，0603，绿色; Part Reference: LED4; Priority: A; PCB Footprint: LED0603; Value: LED_GREEN; Created by: JJJ; Part Type: LED; RK PN: LED_GREEN
R167 = RESISTOR_0: 通用厚膜电阻,100R,+/-5%,R0402,1/16W.; Part Reference: R167; Manufacturer PN: RC0402JR-07100RL; Manufacturer: YAGEO; Wattage: 1/16W; Tolerance: 5%; Priority: A; Value: 100R; Created by: YTL; Part Type: 通用厚膜电阻; RK PN: RC0402JR-07100RL; PCB Footprint: R0402
R168 = RESISTOR_0: 通用厚膜电阻,100R,+/-5%,R0402,1/16W.; Part Reference: R168; Manufacturer: YAGEO; RK PN: RC0402JR-07100RL; Priority: A; Tolerance: 5%; Wattage: 1/16W; Value: 100R; Part Type: 通用厚膜电阻; Manufacturer PN: RC0402JR-07100RL; Created by: YTL; PCB Footprint: R0402
R169 = RESISTOR_0: 通用厚膜电阻,100R,+/-5%,R0402,1/16W.; Part Reference: R169; Manufacturer PN: RC0402JR-07100RL; Manufacturer: YAGEO; Wattage: 1/16W; Tolerance: 5%; Priority: A; Value: NC; Created by: YTL; Part Type: 通用厚膜电阻; RK PN: RC0402JR-07100RL; PCB Footprint: R0603
R170 = RESISTOR_0: 通用厚膜电阻,100R,+/-5%,R0402,1/16W.; Part Reference: R170; Manufacturer: YAGEO; RK PN: RC0402JR-07100RL; Priority: A; Tolerance: 5%; Wattage: 1/16W; Value: 0R; Part Type: 通用厚膜电阻; Manufacturer PN: RC0402JR-07100RL; Created by: YTL; PCB Footprint: R0603
R171 = RESISTOR_0: 通用厚膜电阻,100R,+/-5%,R0402,1/16W.; Part Reference: R171; Manufacturer PN: RC0402JR-07100RL; Manufacturer: YAGEO; Wattage: 1/16W; Tolerance: 5%; Priority: A; Value: NC; Created by: YTL; Part Type: 通用厚膜电阻; RK PN: RC0402JR-07100RL; PCB Footprint: R0603
R172 = RESISTOR_0: 通用厚膜电阻,100R,+/-5%,R0402,1/16W.; Part Reference: R172; Manufacturer PN: RC0402JR-07100RL; Manufacturer: YAGEO; Wattage: 1/16W; Tolerance: 5%; Priority: A; Value: NC; Created by: YTL; Part Type: 通用厚膜电阻; RK PN: RC0402JR-07100RL; PCB Footprint: R0402
R173 = RESISTOR_2: 通用厚膜电阻,330R,+/-5%,R0402,1/16W.; Part Reference: R173; Manufacturer PN: RC0402JR-07330RL; Manufacturer: YAGEO; Wattage: 1/16W; Priority: A; PCB Footprint: R0402; Value: 10K; Created by: YTL; Part Type: 通用厚膜电阻; RK PN: RC0402JR-07330RL
R174 = RESISTOR_2: 通用厚膜电阻,330R,+/-5%,R0402,1/16W.; Part Reference: R174; Manufacturer: YAGEO; RK PN: RC0402JR-07330RL; Priority: A; Wattage: 1/16W; PCB Footprint: R0402; Value: NC; Part Type: 通用厚膜电阻; Manufacturer PN: RC0402JR-07330RL; Created by: YTL
R175 = RESISTOR_2: 通用厚膜电阻,330R,+/-5%,R0402,1/16W.; Part Reference: R175; Manufacturer: YAGEO; RK PN: RC0402JR-07330RL; Priority: A; Wattage: 1/16W; PCB Footprint: R0402; Value: 2.2k; Part Type: 通用厚膜电阻; Manufacturer PN: RC0402JR-07330RL; Created by: YTL
R176 = RESISTOR_0: 通用厚膜电阻,100R,+/-5%,R0402,1/16W.; Part Reference: R176; Manufacturer: YAGEO; RK PN: RC0402JR-07100RL; Priority: A; Tolerance: 5%; Wattage: 1/16W; Value: NC; Part Type: 通用厚膜电阻; Manufacturer PN: RC0402JR-07100RL; Created by: YTL; PCB Footprint: R0402
R177 = RESISTOR_0: 通用厚膜电阻,100R,+/-5%,R0402,1/16W.; Part Reference: R177; Manufacturer PN: RC0402JR-07100RL; Manufacturer: YAGEO; Wattage: 1/16W; Tolerance: 5%; Priority: A; Value: 0R; Created by: YTL; Part Type: 通用厚膜电阻; RK PN: RC0402JR-07100RL; PCB Footprint: R0402
R178 = RESISTOR_2: 通用厚膜电阻,330R,+/-5%,R0402,1/16W.; Part Reference: R178; Manufacturer: YAGEO; RK PN: RC0402JR-07330RL; Priority: A; Wattage: 1/16W; PCB Footprint: R0402; Value: NC; Part Type: 通用厚膜电阻; Manufacturer PN: RC0402JR-07330RL; Created by: YTL
R179 = RESISTOR_2: 通用厚膜电阻,330R,+/-5%,R0402,1/16W.; Part Reference: R179; Manufacturer: YAGEO; RK PN: RC0402JR-07330RL; Priority: A; Wattage: 1/16W; PCB Footprint: R0402; Value: 0R; Part Type: 通用厚膜电阻; Manufacturer PN: RC0402JR-07330RL; Created by: YTL
R180 = RESISTOR_2: 通用厚膜电阻,330R,+/-5%,R0402,1/16W.; Part Reference: R180; Manufacturer PN: RC0402JR-07330RL; Manufacturer: YAGEO; Wattage: 1/16W; Priority: A; PCB Footprint: R0402; Value: 2.2k; Created by: YTL; Part Type: 通用厚膜电阻; RK PN: RC0402JR-07330RL
R181 = RESISTOR_2: 通用厚膜电阻,330R,+/-5%,R0402,1/16W.; Part Reference: R181; Manufacturer PN: RC0402JR-07330RL; Manufacturer: YAGEO; Wattage: 1/16W; Priority: A; PCB Footprint: R0402; Value: 10K; Created by: YTL; Part Type: 通用厚膜电阻; RK PN: RC0402JR-07330RL
R182 = RESISTOR_2: 通用厚膜电阻,330R,+/-5%,R0402,1/16W.; Part Reference: R182; Manufacturer: YAGEO; RK PN: RC0402JR-07330RL; Priority: A; Wattage: 1/16W; PCB Footprint: R0402; Value: NC; Part Type: 通用厚膜电阻; Manufacturer PN: RC0402JR-07330RL; Created by: YTL
R183 = RESISTOR_2: 通用厚膜电阻,330R,+/-5%,R0402,1/16W.; Part Reference: R183; Manufacturer: YAGEO; RK PN: RC0402JR-07330RL; Priority: A; Wattage: 1/16W; PCB Footprint: R0402; Value: 0R; Part Type: 通用厚膜电阻; Manufacturer PN: RC0402JR-07330RL; Created by: YTL
U30 = CON3_0: Part Reference: U30; Value: DIP_2D54MM_14PIN_180; PCB Footprint: DIP_14PIN-2_54MM
U31 = CON3_1: Part Reference: U31; Value: DIP_2.54MM_3PIN_180; PCB Footprint: DIP3_1X2P54
U32 = CON3_1: Part Reference: U32; Value: DIP_2.54MM_3PIN_180; PCB Footprint: DIP3_1X2P54
*#15 = radxa_1010: Page Create Date: March  8, 1995; Page Size: =PageSize; Page Modify Date: =ModifiedDate

## Sheet 17.GPIO+VCC_Connector.SchDoc: CM3 IO
size 386 x 246 mm; Page Create Date: March  8, 1995; Page Number: 17; Page Size: B; Comment: radxa_1010; Page Count: 20; RevCode: 1.36; Doc: GPIO+VCC_Connector; DsnPath: D:\WMS\黄工\[RC119]CM3_IO_V1.36\对外资料\radxa_cm3_io_board_v1360.DSN; SchematicName: CM3_IO V1.36; PageName: 17.GPIO+VCC_Connector; PageSize: B; TopSchematic: True
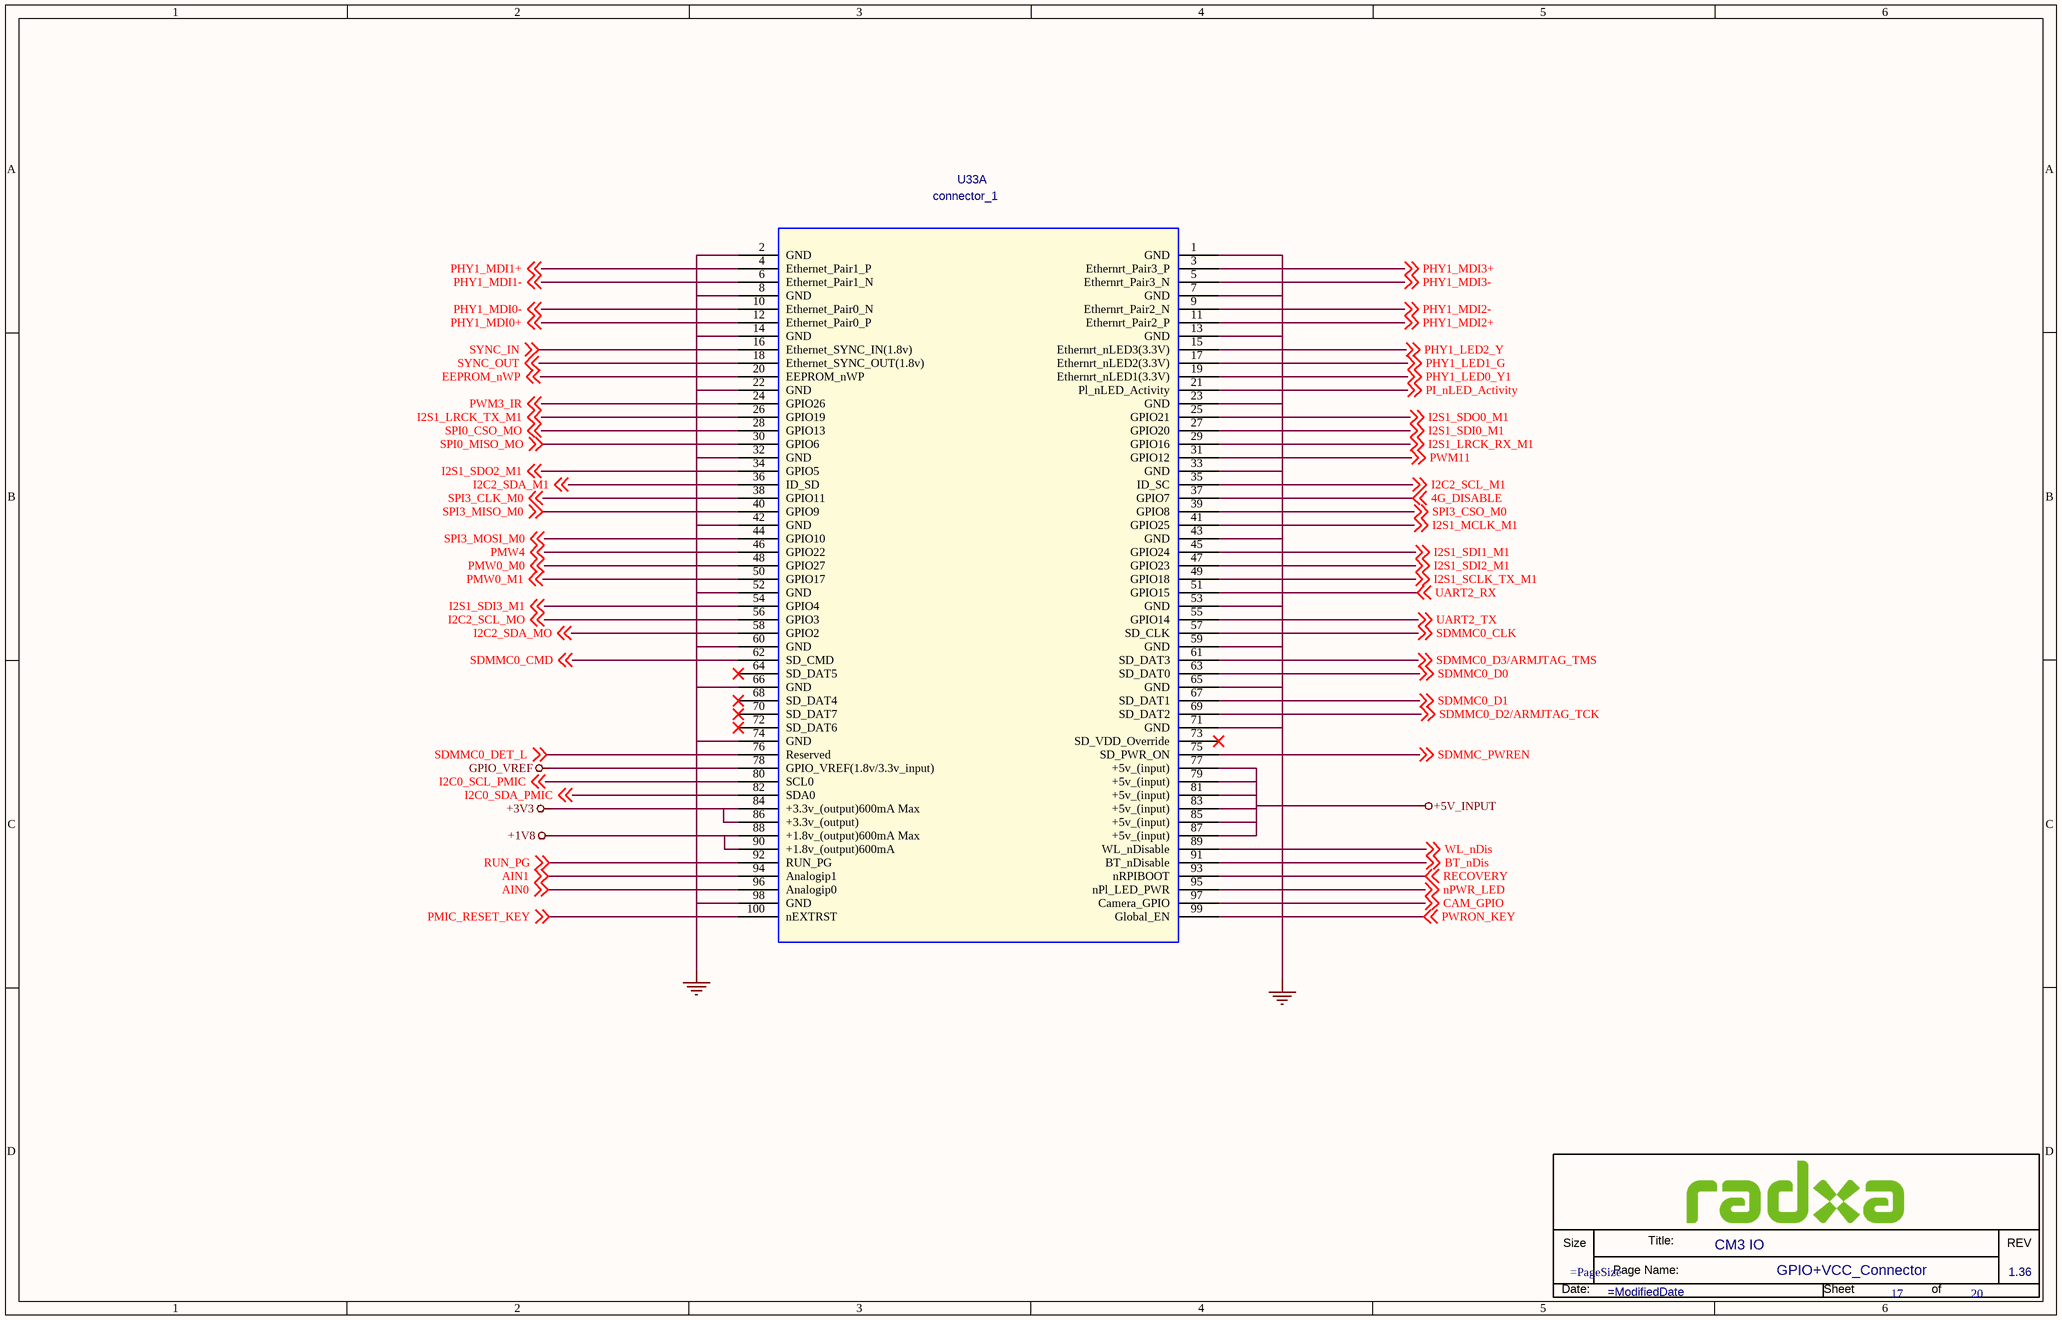
[diagram p15: 17.GPIO+VCC_Connector.SchDoc]

### Parts
(Parts that share a designator on the sheet are numbered #1, #2 ... from top to bottom, then left to right.)
*#16  Doc: GPIO+VCC_Connector  RevCode: 1.36  Title: CM3 IO  Page Number: 17  Page Count: 20  (hidden comment: radxa_1010)  (graphical)
U33  connector_1  [DF40C-200DS-D4-OK]  (part A of 2)

### Nets
+1V8: U33.88(+1.8v_(output)600mA_Max) U33.90(+1.8v_(output)600mA)
+3V3: U33.84(+3.3v_(output)600mA_Max) U33.86(+3.3v_(output))
+5V_INPUT: U33.77(+5v_(input)) U33.79(+5v_(input)) U33.81(+5v_(input)) U33.83(+5v_(input)) U33.85(+5v_(input)) U33.87(+5v_(input))
GND: U33.1(GND) U33.2(GND) U33.7(GND) U33.8(GND) U33.13(GND) U33.14(GND) U33.22(GND) U33.23(GND) U33.32(GND) U33.33(GND) U33.42(GND) U33.43(GND) U33.52(GND) U33.53(GND) U33.59(GND) U33.60(GND) U33.65(GND) U33.66(GND) U33.71(GND) U33.74(GND) U33.98(GND)
GPIO_VREF: U33.78(GPIO_VREF(1.8v/3.3v_input))
4G_DISABLE: U33.37(GPIO7) ; off-sheet 4G_DISABLE
AIN0: U33.96(Analogip0) ; off-sheet AIN0
AIN1: U33.94(Analogip1) ; off-sheet AIN1
BT_nDis: U33.91(BT_nDisable) ; off-sheet BT_nDis
CAM_GPIO: U33.97(Camera_GPIO) ; off-sheet CAM_GPIO
EEPROM_nWP: U33.20(EEPROM_nWP) ; off-sheet EEPROM_nWP
I2C0_SCL_PMIC: U33.80(SCL0) ; off-sheet I2C0_SCL_PMIC
I2C0_SDA_PMIC: U33.82(SDA0) ; off-sheet I2C0_SDA_PMIC
I2C2_SCL_M1: U33.35(ID_SC) ; off-sheet I2C2_SCL_M1
I2C2_SCL_MO: U33.56(GPIO3) ; off-sheet I2C2_SCL_MO
I2C2_SDA_M1: U33.36(ID_SD) ; off-sheet I2C2_SDA_M1
I2C2_SDA_MO: U33.58(GPIO2) ; off-sheet I2C2_SDA_MO
I2S1_LRCK_RX_M1: U33.29(GPIO16) ; off-sheet I2S1_LRCK_RX_M1
I2S1_LRCK_TX_M1: U33.26(GPIO19) ; off-sheet I2S1_LRCK_TX_M1
I2S1_MCLK_M1: U33.41(GPIO25) ; off-sheet I2S1_MCLK_M1
I2S1_SCLK_TX_M1: U33.49(GPIO18) ; off-sheet I2S1_SCLK_TX_M1
I2S1_SDI0_M1: U33.27(GPIO20) ; off-sheet I2S1_SDI0_M1
I2S1_SDI1_M1: U33.45(GPIO24) ; off-sheet I2S1_SDI1_M1
I2S1_SDI2_M1: U33.47(GPIO23) ; off-sheet I2S1_SDI2_M1
I2S1_SDI3_M1: U33.54(GPIO4) ; off-sheet I2S1_SDI3_M1
I2S1_SDO0_M1: U33.25(GPIO21) ; off-sheet I2S1_SDO0_M1
I2S1_SDO2_M1: U33.34(GPIO5) ; off-sheet I2S1_SDO2_M1
nPWR_LED: U33.95(nPl_LED_PWR) ; off-sheet nPWR_LED
PHY1_LED0_Y1: U33.19(Ethernrt_nLED1(3.3V)) ; off-sheet PHY1_LED0_Y1
PHY1_LED1_G: U33.17(Ethernrt_nLED2(3.3V)) ; off-sheet PHY1_LED1_G
PHY1_LED2_Y: U33.15(Ethernrt_nLED3(3.3V)) ; off-sheet PHY1_LED2_Y
PHY1_MDI0+: U33.12(Ethernet_Pair0_P) ; off-sheet PHY1_MDI0+
PHY1_MDI0-: U33.10(Ethernet_Pair0_N) ; off-sheet PHY1_MDI0-
PHY1_MDI1+: U33.4(Ethernet_Pair1_P) ; off-sheet PHY1_MDI1+
PHY1_MDI1-: U33.6(Ethernet_Pair1_N) ; off-sheet PHY1_MDI1-
PHY1_MDI2+: U33.11(Ethernrt_Pair2_P) ; off-sheet PHY1_MDI2+
PHY1_MDI2-: U33.9(Ethernrt_Pair2_N) ; off-sheet PHY1_MDI2-
PHY1_MDI3+: U33.3(Ethernrt_Pair3_P) ; off-sheet PHY1_MDI3+
PHY1_MDI3-: U33.5(Ethernrt_Pair3_N) ; off-sheet PHY1_MDI3-
PI_nLED_Activity: U33.21(Pl_nLED_Activity) ; off-sheet PI_nLED_Activity
PMIC_RESET_KEY: U33.100(nEXTRST) ; off-sheet PMIC_RESET_KEY
PMW0_M0: U33.48(GPIO27) ; off-sheet PMW0_M0
PMW0_M1: U33.50(GPIO17) ; off-sheet PMW0_M1
PMW4: U33.46(GPIO22) ; off-sheet PMW4
PWM3_IR: U33.24(GPIO26) ; off-sheet PWM3_IR
PWM11: U33.31(GPIO12) ; off-sheet PWM11
PWRON_KEY: U33.99(Global_EN) ; off-sheet PWRON_KEY
RECOVERY: U33.93(nRPIBOOT) ; off-sheet RECOVERY
RUN_PG: U33.92(RUN_PG) ; off-sheet RUN_PG
SDMMC0_CLK: U33.57(SD_CLK) ; off-sheet SDMMC0_CLK
SDMMC0_CMD: U33.62(SD_CMD) ; off-sheet SDMMC0_CMD
SDMMC0_D0: U33.63(SD_DAT0) ; off-sheet SDMMC0_D0
SDMMC0_D1: U33.67(SD_DAT1) ; off-sheet SDMMC0_D1
SDMMC0_D2/ARMJTAG_TCK: U33.69(SD_DAT2) ; off-sheet SDMMC0_D2/ARMJTAG_TCK
SDMMC0_D3/ARMJTAG_TMS: U33.61(SD_DAT3) ; off-sheet SDMMC0_D3/ARMJTAG_TMS
SDMMC0_DET_L: U33.76(Reserved) ; off-sheet SDMMC0_DET_L
SDMMC_PWREN: U33.75(SD_PWR_ON) ; off-sheet SDMMC_PWREN
SPI0_CSO_MO: U33.28(GPIO13) ; off-sheet SPI0_CSO_MO
SPI0_MISO_MO: U33.30(GPIO6) ; off-sheet SPI0_MISO_MO
SPI3_CLK_M0: U33.38(GPIO11) ; off-sheet SPI3_CLK_M0
SPI3_CSO_M0: U33.39(GPIO8) ; off-sheet SPI3_CSO_M0
SPI3_MISO_M0: U33.40(GPIO9) ; off-sheet SPI3_MISO_M0
SPI3_MOSI_M0: U33.44(GPIO10) ; off-sheet SPI3_MOSI_M0
SYNC_IN: U33.16(Ethernet_SYNC_IN(1.8v)) ; off-sheet SYNC_IN
SYNC_OUT: U33.18(Ethernet_SYNC_OUT(1.8v)) ; off-sheet SYNC_OUT
UART2_RX: U33.51(GPIO15) ; off-sheet UART2_RX
UART2_TX: U33.55(GPIO14) ; off-sheet UART2_TX
WL_nDis: U33.89(WL_nDisable) ; off-sheet WL_nDis

Not connected (* = marked no-connect by the designer): U33 64(SD_DAT5)* 68(SD_DAT4)* 70(SD_DAT7)* 72(SD_DAT6)* 73(SD_VDD_Override)*

### Notes on the sheet
- (in symbol radxa_1010) Title:; Size; REV; Page Name:; Date:; Sheet; of

### Library data of the parts
U33 = HETER_4: Part Reference: U33; Value: connector_1; PCB Footprint: DF40C-200DS-D4-OK
*#16 = radxa_1010: Page Create Date: March  8, 1995; Page Size: =PageSize; Page Modify Date: =ModifiedDate

## Sheet 18.High Speed Serial_Connector.SchDoc: CM3 IO
size 386 x 246 mm; Page Create Date: March  8, 1995; Page Number: 18; Page Size: B; Comment: radxa_1010; Page Count: 20; RevCode: 1.36; Doc: High Speed Serial_Connector; DsnPath: D:\WMS\黄工\[RC119]CM3_IO_V1.36\对外资料\radxa_cm3_io_board_v1360.DSN; SchematicName: CM3_IO V1.36; PageName: 18.High Speed Serial_Connector; PageSize: B; TopSchematic: True
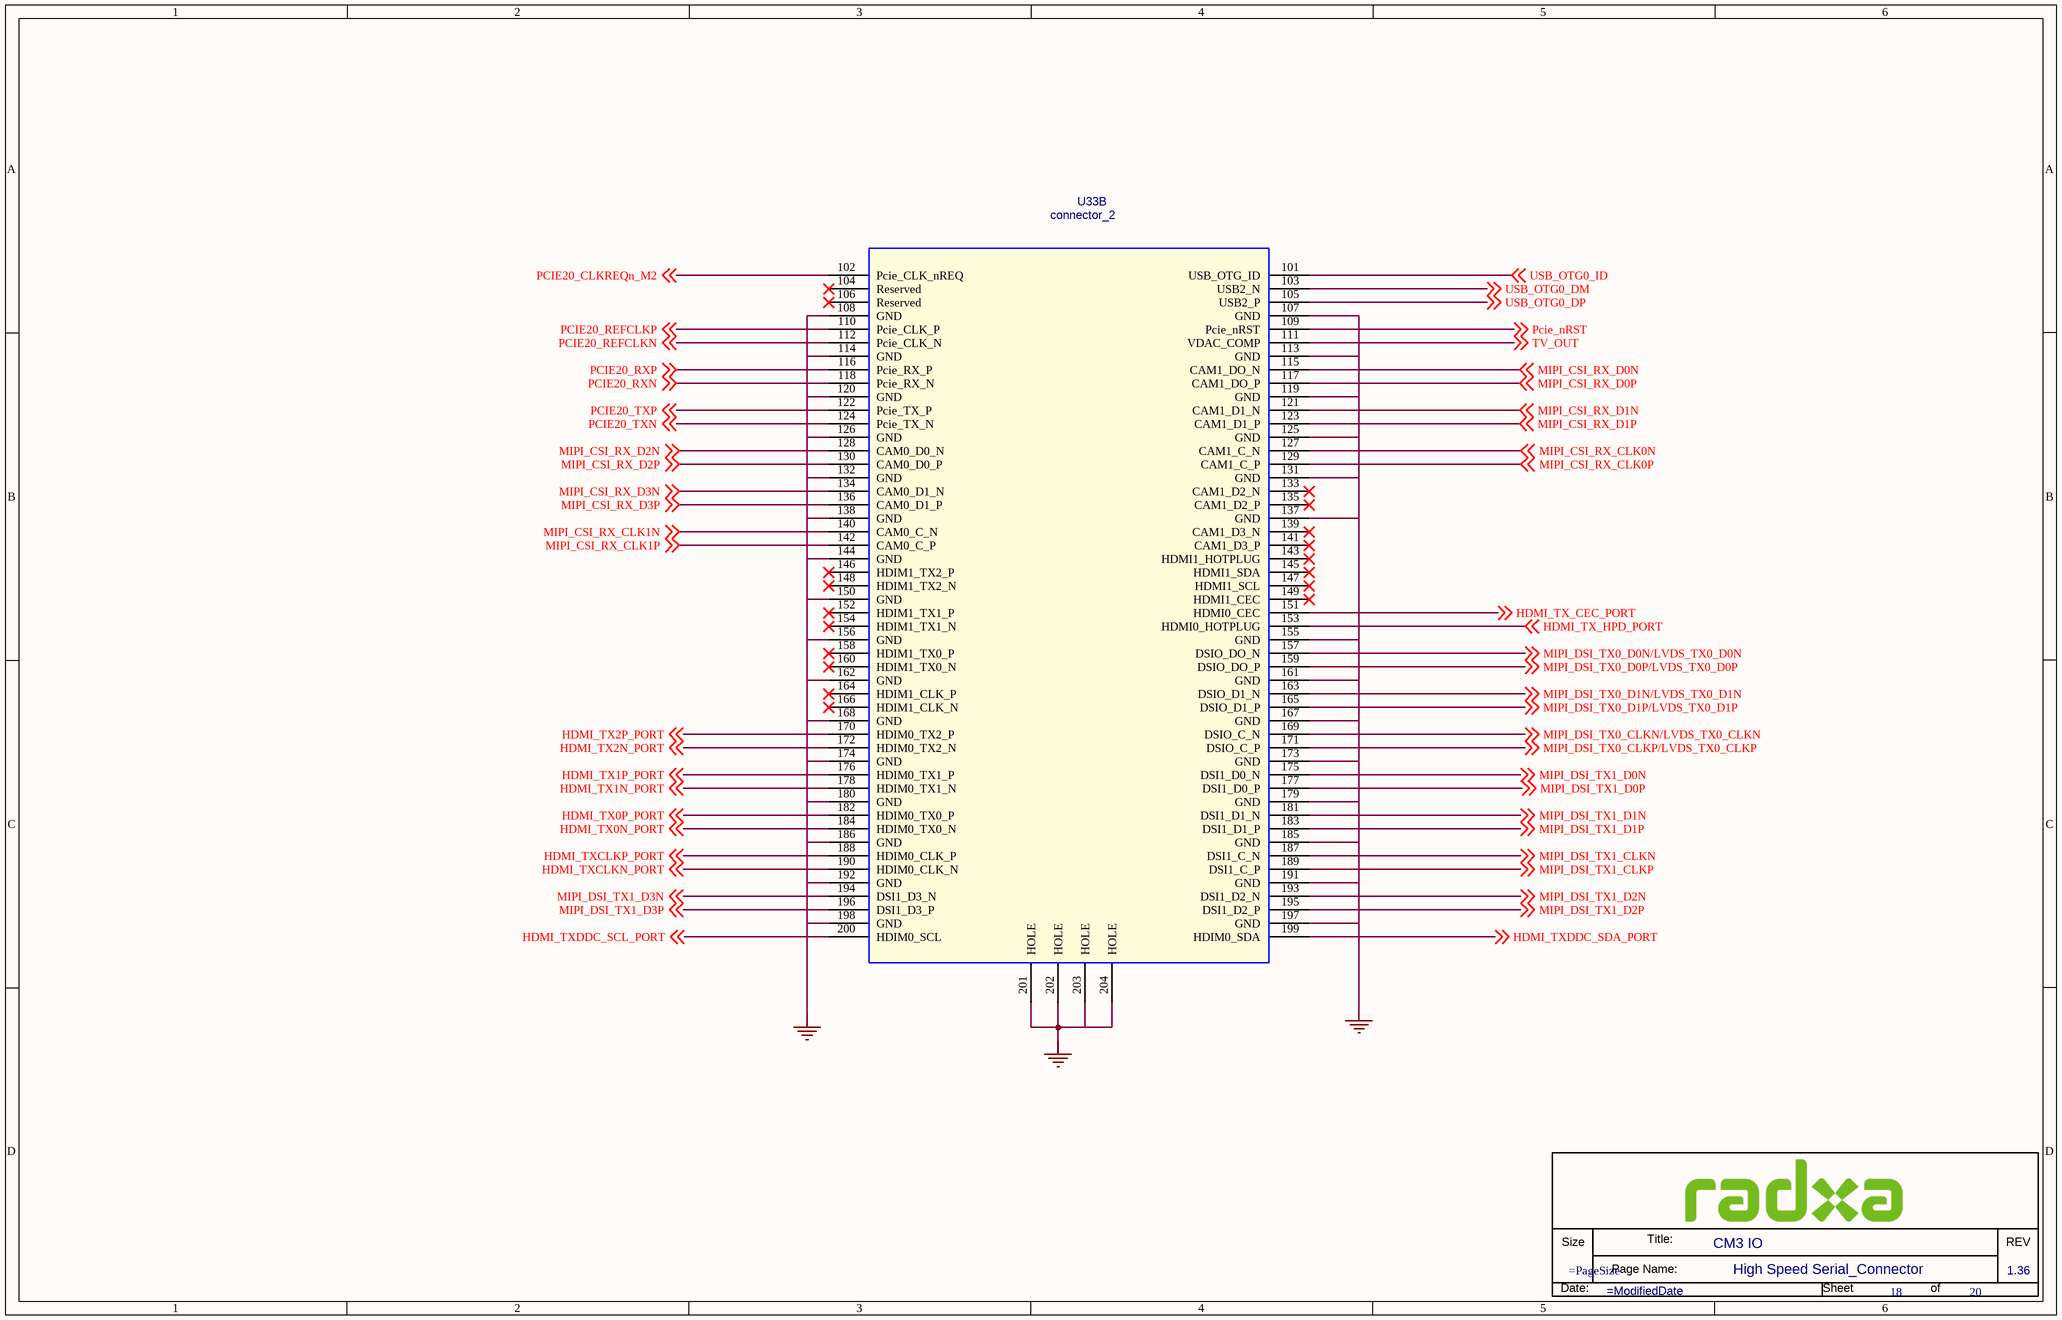
[diagram p16: 18.High Speed Serial_Connector.SchDoc]

### Parts
(Parts that share a designator on the sheet are numbered #1, #2 ... from top to bottom, then left to right.)
*#17  Doc: High Speed Serial_Connector  RevCode: 1.36  Title: CM3 IO  Page Number: 18  Page Count: 20  (hidden comment: radxa_1010)  (graphical)
U33  connector_2  [DF40C-200DS-D4-OK]  (part B of 2)

### Nets
GND: U33.107(GND) U33.108(GND) U33.113(GND) U33.114(GND) U33.119(GND) U33.120(GND) U33.125(GND) U33.126(GND) U33.131(GND) U33.132(GND) U33.137(GND) U33.138(GND) U33.144(GND) U33.150(GND) U33.155(GND) U33.156(GND) U33.161(GND) U33.162(GND) U33.167(GND) U33.168(GND) U33.173(GND) U33.174(GND) U33.179(GND) U33.180(GND) U33.185(GND) U33.186(GND) U33.191(GND) U33.192(GND) U33.197(GND) U33.198(GND) U33.201(HOLE) U33.202(HOLE) U33.203(HOLE) U33.204(HOLE)
HDMI_TX0N_PORT: U33.184(HDIM0_TX0_N) ; off-sheet HDMI_TX0N_PORT
HDMI_TX0P_PORT: U33.182(HDIM0_TX0_P) ; off-sheet HDMI_TX0P_PORT
HDMI_TX1N_PORT: U33.178(HDIM0_TX1_N) ; off-sheet HDMI_TX1N_PORT
HDMI_TX1P_PORT: U33.176(HDIM0_TX1_P) ; off-sheet HDMI_TX1P_PORT
HDMI_TX2N_PORT: U33.172(HDIM0_TX2_N) ; off-sheet HDMI_TX2N_PORT
HDMI_TX2P_PORT: U33.170(HDIM0_TX2_P) ; off-sheet HDMI_TX2P_PORT
HDMI_TX_CEC_PORT: U33.151(HDMI0_CEC) ; off-sheet HDMI_TX_CEC_PORT
HDMI_TX_HPD_PORT: U33.153(HDMI0_HOTPLUG) ; off-sheet HDMI_TX_HPD_PORT
HDMI_TXCLKN_PORT: U33.190(HDIM0_CLK_N) ; off-sheet HDMI_TXCLKN_PORT
HDMI_TXCLKP_PORT: U33.188(HDIM0_CLK_P) ; off-sheet HDMI_TXCLKP_PORT
HDMI_TXDDC_SCL_PORT: U33.200(HDIM0_SCL) ; off-sheet HDMI_TXDDC_SCL_PORT
HDMI_TXDDC_SDA_PORT: U33.199(HDIM0_SDA) ; off-sheet HDMI_TXDDC_SDA_PORT
MIPI_CSI_RX_CLK0N: U33.127(CAM1_C_N) ; off-sheet MIPI_CSI_RX_CLK0N
MIPI_CSI_RX_CLK0P: U33.129(CAM1_C_P) ; off-sheet MIPI_CSI_RX_CLK0P
MIPI_CSI_RX_CLK1N: U33.140(CAM0_C_N) ; off-sheet MIPI_CSI_RX_CLK1N
MIPI_CSI_RX_CLK1P: U33.142(CAM0_C_P) ; off-sheet MIPI_CSI_RX_CLK1P
MIPI_CSI_RX_D0N: U33.115(CAM1_DO_N) ; off-sheet MIPI_CSI_RX_D0N
MIPI_CSI_RX_D0P: U33.117(CAM1_DO_P) ; off-sheet MIPI_CSI_RX_D0P
MIPI_CSI_RX_D1N: U33.121(CAM1_D1_N) ; off-sheet MIPI_CSI_RX_D1N
MIPI_CSI_RX_D1P: U33.123(CAM1_D1_P) ; off-sheet MIPI_CSI_RX_D1P
MIPI_CSI_RX_D2N: U33.128(CAM0_D0_N) ; off-sheet MIPI_CSI_RX_D2N
MIPI_CSI_RX_D2P: U33.130(CAM0_D0_P) ; off-sheet MIPI_CSI_RX_D2P
MIPI_CSI_RX_D3N: U33.134(CAM0_D1_N) ; off-sheet MIPI_CSI_RX_D3N
MIPI_CSI_RX_D3P: U33.136(CAM0_D1_P) ; off-sheet MIPI_CSI_RX_D3P
MIPI_DSI_TX0_CLKN/LVDS_TX0_CLKN: U33.169(DSIO_C_N) ; off-sheet MIPI_DSI_TX0_CLKN/LVDS_TX0_CLKN
MIPI_DSI_TX0_CLKP/LVDS_TX0_CLKP: U33.171(DSIO_C_P) ; off-sheet MIPI_DSI_TX0_CLKP/LVDS_TX0_CLKP
MIPI_DSI_TX0_D0N/LVDS_TX0_D0N: U33.157(DSIO_DO_N) ; off-sheet MIPI_DSI_TX0_D0N/LVDS_TX0_D0N
MIPI_DSI_TX0_D0P/LVDS_TX0_D0P: U33.159(DSIO_DO_P) ; off-sheet MIPI_DSI_TX0_D0P/LVDS_TX0_D0P
MIPI_DSI_TX0_D1N/LVDS_TX0_D1N: U33.163(DSIO_D1_N) ; off-sheet MIPI_DSI_TX0_D1N/LVDS_TX0_D1N
MIPI_DSI_TX0_D1P/LVDS_TX0_D1P: U33.165(DSIO_D1_P) ; off-sheet MIPI_DSI_TX0_D1P/LVDS_TX0_D1P
MIPI_DSI_TX1_CLKN: U33.187(DSI1_C_N) ; off-sheet MIPI_DSI_TX1_CLKN
MIPI_DSI_TX1_CLKP: U33.189(DSI1_C_P) ; off-sheet MIPI_DSI_TX1_CLKP
MIPI_DSI_TX1_D0N: U33.175(DSI1_D0_N) ; off-sheet MIPI_DSI_TX1_D0N
MIPI_DSI_TX1_D0P: U33.177(DSI1_D0_P) ; off-sheet MIPI_DSI_TX1_D0P
MIPI_DSI_TX1_D1N: U33.181(DSI1_D1_N) ; off-sheet MIPI_DSI_TX1_D1N
MIPI_DSI_TX1_D1P: U33.183(DSI1_D1_P) ; off-sheet MIPI_DSI_TX1_D1P
MIPI_DSI_TX1_D2N: U33.193(DSI1_D2_N) ; off-sheet MIPI_DSI_TX1_D2N
MIPI_DSI_TX1_D2P: U33.195(DSI1_D2_P) ; off-sheet MIPI_DSI_TX1_D2P
MIPI_DSI_TX1_D3N: U33.194(DSI1_D3_N) ; off-sheet MIPI_DSI_TX1_D3N
MIPI_DSI_TX1_D3P: U33.196(DSI1_D3_P) ; off-sheet MIPI_DSI_TX1_D3P
PCIE20_CLKREQn_M2: U33.102(Pcie_CLK_nREQ) ; off-sheet PCIE20_CLKREQn_M2
PCIE20_REFCLKN: U33.112(Pcie_CLK_N) ; off-sheet PCIE20_REFCLKN
PCIE20_REFCLKP: U33.110(Pcie_CLK_P) ; off-sheet PCIE20_REFCLKP
PCIE20_RXN: U33.118(Pcie_RX_N) ; off-sheet PCIE20_RXN
PCIE20_RXP: U33.116(Pcie_RX_P) ; off-sheet PCIE20_RXP
PCIE20_TXN: U33.124(Pcie_TX_N) ; off-sheet PCIE20_TXN
PCIE20_TXP: U33.122(Pcie_TX_P) ; off-sheet PCIE20_TXP
Pcie_nRST: U33.109(Pcie_nRST) ; off-sheet Pcie_nRST
TV_OUT: U33.111(VDAC_COMP) ; off-sheet TV_OUT
USB_OTG0_DM: U33.103(USB2_N) ; off-sheet USB_OTG0_DM
USB_OTG0_DP: U33.105(USB2_P) ; off-sheet USB_OTG0_DP
USB_OTG0_ID: U33.101(USB_OTG_ID) ; off-sheet USB_OTG0_ID

Not connected (* = marked no-connect by the designer): U33 104(Reserved)* 106(Reserved)* 133(CAM1_D2_N)* 135(CAM1_D2_P)* 139(CAM1_D3_N)* 141(CAM1_D3_P)* 143(HDMI1_HOTPLUG)* 145(HDMI1_SDA)* 146(HDIM1_TX2_P)* 147(HDMI1_SCL)* 148(HDIM1_TX2_N)* 149(HDMI1_CEC)* 152(HDIM1_TX1_P)* 154(HDIM1_TX1_N)* 158(HDIM1_TX0_P)* 160(HDIM1_TX0_N)* 164(HDIM1_CLK_P)* 166(HDIM1_CLK_N)*

### Notes on the sheet
- (in symbol radxa_1010) Size; Title:; REV; Page Name:; Date:; Sheet; of

### Library data of the parts
U33 = HETER_4: Part Reference: U33; Value: connector_2; PCB Footprint: DF40C-200DS-D4-OK
*#17 = radxa_1010: Page Create Date: March  8, 1995; Page Size: =PageSize; Page Modify Date: =ModifiedDate